# Altium schematic sheet CAN_RS232_Router.SCHDOC: CAN to RS232 Router
size C; Organization: Altium Limited; Address1: L3, 12a Rodborough Rd; Address2: Frenchs Forest; Address3: NSW; Address4: Australia 2086; DocumentNumber: 1; SheetNumber: 1; SheetTotal: 2
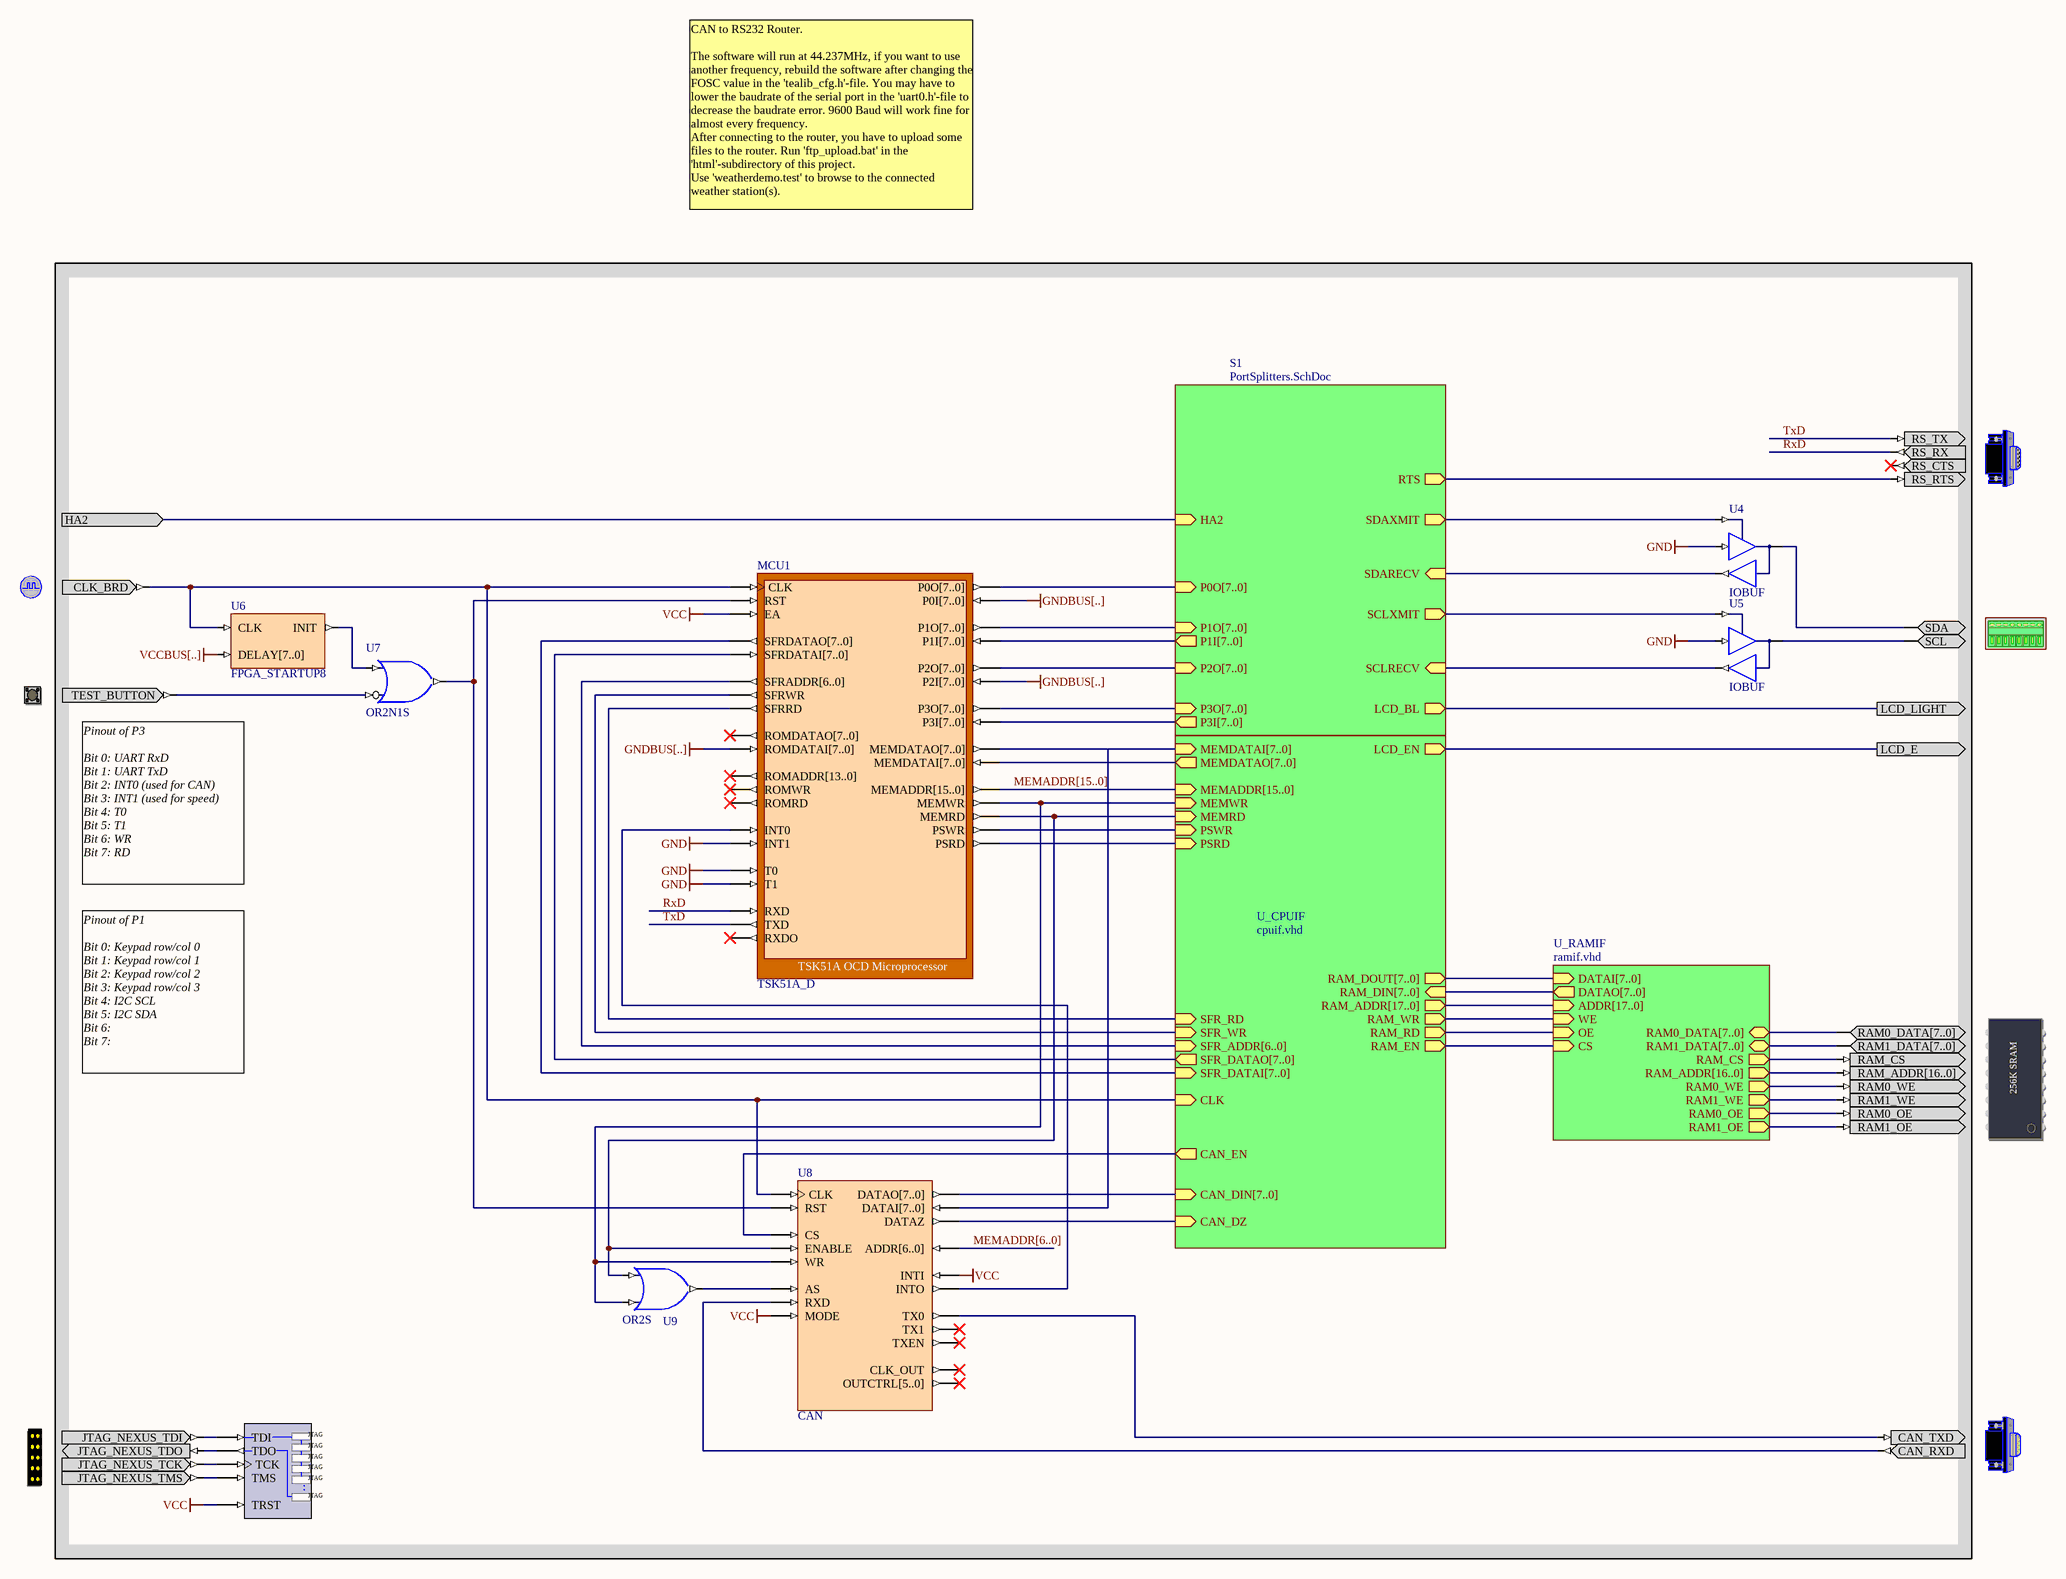
[diagram p0: CAN_RS232_Router.SCHDOC]

## Parts
(Parts that share a designator on the sheet are numbered #1, #2 ... from top to bottom, then left to right.)
?#1  RS232CNTR  (value not drawn)
?#2  CLOCK_BOARD  (value not drawn)
?#3  ADCDAC_I2C  (value not drawn)
?#4  TEST_BUTTON  (value not drawn)
?#5  MEMORY256KX8  (value not drawn)
?#6  CANCNTR  (value not drawn)
?#7  NEXUS_JTAG_CONNECTOR  (value not drawn)
MCU1  TSK51A_D
NEXUS_JTAG_PORT  NEXUS_JTAG_PORT  (value not drawn)
U4  IOBUF
U5  IOBUF
U6  FPGA_STARTUP8
U7  OR2N1S
U8  CAN
U9  OR2S

## Sub-sheets
S1 = PortSplitters.SchDoc: P0O[7..0] (in), P1O[7..0] (in), P1I[7..0] (out), P2O[7..0] (in), P3O[7..0] (in), P3I[7..0] (out), HA2 (in), SCLXMIT (out), LCD_BL (out), RTS (out), SDAXMIT (out), SCLRECV (in), SDARECV (in)
U_CPUIF = cpuif.vhd: MEMWR (in), RAM_EN (out), RAM_WR (out), RAM_RD (out), RAM_DOUT[7..0] (out), MEMRD (in), LCD_EN (out), RAM_ADDR[17..0] (out), CLK (in), SFR_ADDR[6..0] (in), SFR_DATAI[7..0] (in), SFR_DATAO[7..0] (out), SFR_WR (in), SFR_RD (in), RAM_DIN[7..0] (in), PSWR (in), PSRD (in), MEMADDR[15..0] (in), MEMDATAI[7..0] (in), MEMDATAO[7..0] (out), CAN_EN (out), CAN_DIN[7..0] (in), CAN_DZ (in)
U_RAMIF = ramif.vhd: DATAI[7..0] (in), DATAO[7..0] (out), ADDR[17..0] (in), WE (in), OE (in), CS (in), RAM0_DATA[7..0] (bidir), RAM1_DATA[7..0] (bidir), RAM_ADDR[16..0] (out), RAM0_WE (out), RAM1_WE (out), RAM0_OE (out), RAM1_OE (out), RAM_CS (out)

## Ports
HA2 (in), LCD_E (out), LCD_LIGHT (out)

## Nets
GND: MCU1.INT1 MCU1.T0 MCU1.T1 U4.I U5.I
GNDBUS[..]: MCU1.P0I[7..0] MCU1.P2I[7..0] MCU1.ROMDATAI[7..0]
VCC: MCU1.EA NEXUS_JTAG_PORT.TRST U8.INTI U8.MODE
VCCBUS[..]: U6.DELAY[7..0]
HA2: port HA2, sheet S1/HA2
LCD_E: port LCD_E, sheet U_CPUIF/LCD_EN
LCD_LIGHT: port LCD_LIGHT, sheet S1/LCD_BL
MEMADDR[6..0]: U8.ADDR[6..0]
MEMADDR[15..0]: MCU1.MEMADDR[15..0] ; sheet U_CPUIF/MEMADDR[15..0]
RxD: ?#1.RS_RX MCU1.RXD
TxD: ?#1.RS_TX MCU1.TXD
Net?#1_RS_RTS: ?#1.RS_RTS ; sheet S1/RTS
Net?#2_CLK_BRD: ?#2.CLK_BRD MCU1.CLK U6.CLK U8.CLK ; sheet U_CPUIF/CLK
Net?#3_SCL: ?#3.SCL U5.IO
Net?#3_SDA: ?#3.SDA U4.IO
Net?#4_TEST_BUTTON: ?#4.TEST_BUTTON U7.I0
Net?#5_RAM0_DATA[7..0]: ?#5.RAM0_DATA[7..0] ; sheet U_RAMIF/RAM0_DATA[7..0]
Net?#5_RAM0_OE: ?#5.RAM0_OE ; sheet U_RAMIF/RAM0_OE
Net?#5_RAM0_WE: ?#5.RAM0_WE ; sheet U_RAMIF/RAM0_WE
Net?#5_RAM1_DATA[7..0]: ?#5.RAM1_DATA[7..0] ; sheet U_RAMIF/RAM1_DATA[7..0]
Net?#5_RAM1_OE: ?#5.RAM1_OE ; sheet U_RAMIF/RAM1_OE
Net?#5_RAM1_WE: ?#5.RAM1_WE ; sheet U_RAMIF/RAM1_WE
Net?#5_RAM_ADDR[16..0]: ?#5.RAM_ADDR[16..0] ; sheet U_RAMIF/RAM_ADDR[16..0]
Net?#5_RAM_CS: ?#5.RAM_CS ; sheet U_RAMIF/RAM_CS
Net?#6_CAN_RXD: ?#6.CAN_RXD U8.RXD
Net?#6_CAN_TXD: ?#6.CAN_TXD U8.TX0
Net?#7_JTAG_NEXUS_TCK: ?#7.JTAG_NEXUS_TCK NEXUS_JTAG_PORT.TCK
Net?#7_JTAG_NEXUS_TDI: ?#7.JTAG_NEXUS_TDI NEXUS_JTAG_PORT.TDI
Net?#7_JTAG_NEXUS_TDO: ?#7.JTAG_NEXUS_TDO NEXUS_JTAG_PORT.TDO
Net?#7_JTAG_NEXUS_TMS: ?#7.JTAG_NEXUS_TMS NEXUS_JTAG_PORT.TMS
NetMCU1_INT0: MCU1.INT0 U8.INTO
NetMCU1_MEMDATAI[7..0]: MCU1.MEMDATAI[7..0] ; sheet U_CPUIF/MEMDATAO[7..0]
NetMCU1_MEMDATAO[7..0]: MCU1.MEMDATAO[7..0] U8.DATAI[7..0] ; sheet U_CPUIF/MEMDATAI[7..0]
NetMCU1_MEMRD: MCU1.MEMRD U8.ENABLE U9.I0 ; sheet U_CPUIF/MEMRD
NetMCU1_MEMWR: MCU1.MEMWR U8.WR U9.I1 ; sheet U_CPUIF/MEMWR
NetMCU1_P0O[7..0]: MCU1.P0O[7..0] ; sheet S1/P0O[7..0]
NetMCU1_P1I[7..0]: MCU1.P1I[7..0] ; sheet S1/P1I[7..0]
NetMCU1_P1O[7..0]: MCU1.P1O[7..0] ; sheet S1/P1O[7..0]
NetMCU1_P2O[7..0]: MCU1.P2O[7..0] ; sheet S1/P2O[7..0]
NetMCU1_P3I[7..0]: MCU1.P3I[7..0] ; sheet S1/P3I[7..0]
NetMCU1_P3O[7..0]: MCU1.P3O[7..0] ; sheet S1/P3O[7..0]
NetMCU1_PSRD: MCU1.PSRD ; sheet U_CPUIF/PSRD
NetMCU1_PSWR: MCU1.PSWR ; sheet U_CPUIF/PSWR
NetMCU1_RST: MCU1.RST U7.O U8.RST
NetMCU1_SFRADDR[6..0]: MCU1.SFRADDR[6..0] ; sheet U_CPUIF/SFR_ADDR[6..0]
NetMCU1_SFRDATAI[7..0]: MCU1.SFRDATAI[7..0] ; sheet U_CPUIF/SFR_DATAO[7..0]
NetMCU1_SFRDATAO[7..0]: MCU1.SFRDATAO[7..0] ; sheet U_CPUIF/SFR_DATAI[7..0]
NetMCU1_SFRRD: MCU1.SFRRD ; sheet U_CPUIF/SFR_RD
NetMCU1_SFRWR: MCU1.SFRWR ; sheet U_CPUIF/SFR_WR
NetU4_O: U4.O ; sheet S1/SDARECV
NetU4_T: U4.T ; sheet S1/SDAXMIT
NetU5_O: U5.O ; sheet S1/SCLRECV
NetU5_T: U5.T ; sheet S1/SCLXMIT
NetU6_INIT: U6.INIT U7.I1
NetU8_AS: U8.AS U9.O
NetU8_CS: U8.CS ; sheet U_CPUIF/CAN_EN
NetU8_DATAO[7..0]: U8.DATAO[7..0] ; sheet U_CPUIF/CAN_DIN[7..0]
NetU8_DATAZ: U8.DATAZ ; sheet U_CPUIF/CAN_DZ
(unnamed): sheet U_CPUIF/RAM_EN, sheet U_RAMIF/CS
(unnamed): sheet U_CPUIF/RAM_WR, sheet U_RAMIF/WE
(unnamed): sheet U_CPUIF/RAM_RD, sheet U_RAMIF/OE

Not connected (* = marked no-connect by the designer): ?#1 RS_CTS*; MCU1 ROMADDR[13..0]* ROMDATAO[7..0]* ROMRD* ROMWR* RXDO*; U8 CLK_OUT* OUTCTRL[5..0]* TX1* TXEN*

## Buses and harness runs
bus MEMADDR[6..0]
bus MEMADDR[15..0] = sheet U_CPUIF/MEMADDR[15..0]
bus sheet U_CPUIF/RAM_ADDR[17..0] = sheet U_RAMIF/ADDR[17..0]
bus sheet U_CPUIF/RAM_DIN[7..0] = sheet U_RAMIF/DATAO[7..0]
bus sheet U_CPUIF/RAM_DOUT[7..0] = sheet U_RAMIF/DATAI[7..0]

## Notes on the sheet
- CAN to RS232 Router.
  The software will run at 44.237MHz, if you want to use another frequency, rebuild the software after changing the FOSC value in the 'tealib_cfg.h'-file. You may have to lower the baudrate of the serial port in the 'uart0.h'-file to decrease the baudrate error. 9600 Baud will work fine for almost every frequency.
  After connecting to the router, you have to upload some files to the router. Run 'ftp_upload.bat' in the 'html'-subdirectory of this project.
  Use 'weatherdemo.test' to browse to the connected weather station(s).
- Pinout of P3
  Bit 0: UART RxD
  Bit 1: UART TxD
  Bit 2: INT0 (used for CAN)
  Bit 3: INT1 (used for speed)
  Bit 4: T0
  Bit 5: T1
  Bit 6: WR
  Bit 7: RD
- Pinout of P1
  Bit 0: Keypad row/col 0
  Bit 1: Keypad row/col 1
  Bit 2: Keypad row/col 2
  Bit 3: Keypad row/col 3
  Bit 4: I2C SCL
  Bit 5: I2C SDA
  Bit 6:
  Bit 7:
- Title
- Size:
- Date:
- File:
- C
- Number:
- Time:
- Revision:
- Sheet
- of
- (in symbol MEMORY256KX8) 256K SRAM
- (in symbol NEXUS_JTAG_PORT) JTAG; .

## Library data of the parts
?#1 = RS232CNTR: DCE Serial Port Connector; PortComponent: True; Published: 19-Nov-2003; Publisher: Altium Limited
?#2 = CLOCK_BOARD: Global System Clock Supply; PortComponent: True; Published: 19-Nov-2003; Publisher: Altium Limited
?#3 = ADCDAC_I2C: Analog Digital/ Digital Analog Converter, I2C Interface; PortComponent: True; Published: 19-Nov-2003; Publisher: Altium Limited
?#4 = TEST_BUTTON: Test Button; PortComponent: True; Published: 19-Nov-2003; Publisher: Altium Limited
?#5 = MEMORY256KX8: SRAM 256kx8; PortComponent: True; Published: 19-Nov-2003; Publisher: Altium Limited
?#6 = CANCNTR: CAN Bus Connector; PortComponent: True; Published: 19-Nov-2003; Publisher: Altium Limited
?#7 = NEXUS_JTAG_CONNECTOR: JTAG Port; PortComponent: True; Published: 19-Nov-2003; Publisher: Altium Limited
MCU1 = TSK51A_D: TSK51A OCD Microprocessor; NEXUS_CORE: Processor_OCDS; NEXUS_JTAG_DEVICE: True; NEXUS_JTAG_ORDER: 0; ChildModel1: RAM256x8_TSK51D; Published: 23/10/2003; Publisher: Altium Hobart Technology Centre; Core Revision: 1.00.00
NEXUS_JTAG_PORT = NEXUS_JTAG_PORT: Nexus Processor JTAG Chain Connector; NEXUS_JTAG_CONNECTOR: True; Published: 18-Nov-2003; Publisher: Altium Limited
U4 U5 = IOBUF: Input/Output Buffer; ArchiveName: GENERIC; Published: 9-30-2003; Publisher: Altium Limited; Xilinx Equivalent: IOBUF; Core Revision: 1.00.00
U6 = FPGA_STARTUP8: FPGA Startup With 8 Bit Delay; Published: 21/01/2004; Publisher: Altium Hobart Technology Centre; Core Revision: 1.00.00
U7 = OR2N1S: 2-Input OR Gate with Active Low A Input, Single Pin Version; Xilinx Equivalent: OR2B1; ArchiveName: GENERIC; Published: 18-Dec-2003; Publisher: Altium Limited; Core Revision: 1.00.00
U8 = CAN: CAN Controller; ChildModel1: CAN10000_DRAM8X64; Published: 18/12/2003; Publisher: Altium Hobart Technology Centre; Core Revision: 1.00.00
U9 = OR2S: 2-Input OR Gate, Single Pin Version; Xilinx Equivalent: OR2; ArchiveName: GENERIC; VHDLIB_SIM: GENERIC_LIB; Published: 29-Jan-2004; Publisher: Altium Limited; Core Revision: 1.00.00